# EAGLE design quadcopter (EAGLE 8.1.1)
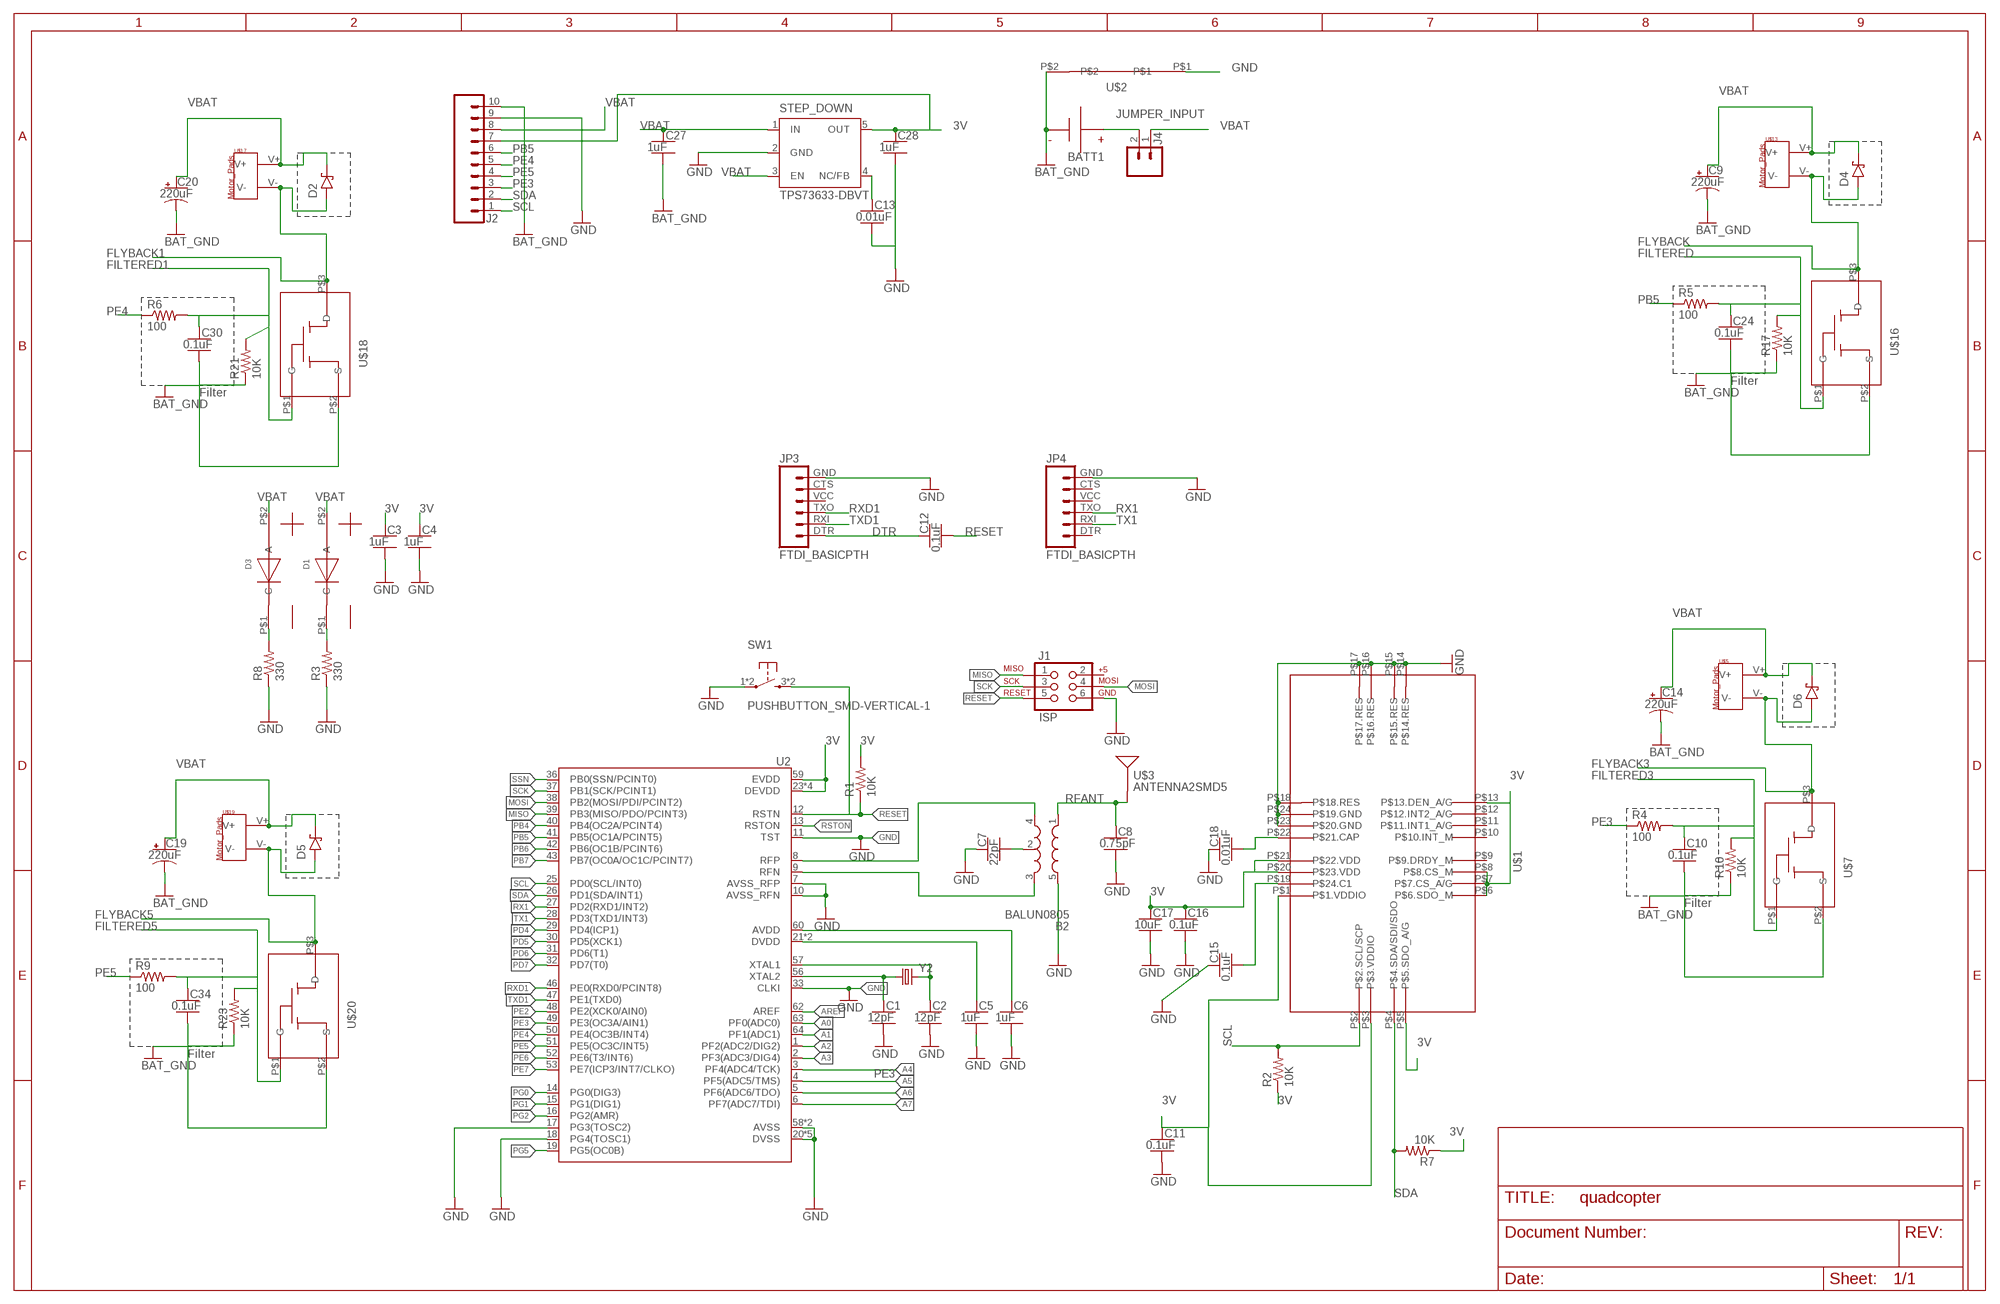
[diagram p0: schematic, sheet 1]

## Parts
B2  BALUN0805  [BALUN]
BATT1  BATTERY-HUBSAN-W/HOLDER  [BATTERY-W/HOLDER-380MAH-HUBSAN]
C1  12pF  CAPACITOR-NP_SMD-2012-0805_CERAMIC-12PF  [CAPC2012X140_HS]
C2  12pF  CAPACITOR-NP_SMD-2012-0805_CERAMIC-12PF  [CAPC2012X140_HS]
C3  1uF  CAPACITOR-NP_SMD-2012-0805_CERAMIC-1UF  [CAPC2012X140_HS]
C4  1uF  CAPACITOR-NP_SMD-2012-0805_CERAMIC-1UF  [CAPC2012X140_HS]
C5  1uF  CAPACITOR-NP_SMD-2012-0805_CERAMIC-1UF  [CAPC2012X140_HS]
C6  1uF  CAPACITOR-NP_SMD-2012-0805_CERAMIC-1UF  [CAPC2012X140_HS]
C7  22pF  CAPACITOR-NP_SMD-2012-0805_CERAMIC-22PF  [CAPC2012X140_HS]
C8  0.75pF  CAPACITOR-NP_SMD-2012-0805_CERAMIC-0.75PF  [CAPC2012X140_HS]
C9  220uF  CAPACITOR-POL_SMD-7043-D_TANTALUM-220UF  [CAPMP7343X310_HS]
C10  0.1uF  CAPACITOR-NP_SMD-2012-0805_CERAMIC-0.1UF  [CAPC2012X140_HS]
C11  0.1uF  CAPACITOR-NP_SMD-2012-0805_CERAMIC-0.1UF  [CAPC2012X140_HS]
C12  0.1uF  CAPACITOR-NP_SMD-2012-0805_CERAMIC-0.1UF  [CAPC2012X140_HS]
C13  0.01uF  CAPACITOR-NP_SMD-2012-0805_CERAMIC-0.01UF  [CAPC2012X140_HS]
C14  220uF  CAPACITOR-POL_SMD-7043-D_TANTALUM-220UF  [CAPMP7343X310_HS]
C15  0.1uF  CAPACITOR-NP_SMD-2012-0805_CERAMIC-0.1UF  [CAPC2012X140_HS]
C16  0.1uF  CAPACITOR-NP_SMD-2012-0805_CERAMIC-0.1UF  [CAPC2012X140_HS]
C17  10uF  CAPACITOR-NP_SMD-2012-0805_CERAMIC-10UF  [CAPC2012X140_HS]
C18  0.01uF  CAPACITOR-NP_SMD-2012-0805_CERAMIC-0.01UF  [CAPC2012X140_HS]
C19  220uF  CAPACITOR-POL_SMD-7043-D_TANTALUM-220UF  [CAPMP7343X310_HS]
C20  220uF  CAPACITOR-POL_SMD-7043-D_TANTALUM-220UF  [CAPMP7343X310_HS]
C24  0.1uF  CAPACITOR-NP_SMD-2012-0805_CERAMIC-0.1UF  [CAPC2012X140_HS]
C27  1uF  CAPACITOR-NP_SMD-2012-0805_CERAMIC-1UF  [CAPC2012X140_HS]
C28  1uF  CAPACITOR-NP_SMD-2012-0805_CERAMIC-1UF  [CAPC2012X140_HS]
C30  0.1uF  CAPACITOR-NP_SMD-2012-0805_CERAMIC-0.1UF  [CAPC2012X140_HS]
C34  0.1uF  CAPACITOR-NP_SMD-2012-0805_CERAMIC-0.1UF  [CAPC2012X140_HS]
D1  LED-RED  [RED_LED]
D2  DIODE-SCHOTTKY_SMD-SOD123  [SOD3716X135_HS]
D3  LED-RED  [RED_LED]
D4  DIODE-SCHOTTKY_SMD-SOD123  [SOD3716X135_HS]
D5  DIODE-SCHOTTKY_SMD-SOD123  [SOD3716X135_HS]
D6  DIODE-SCHOTTKY_SMD-SOD123  [SOD3716X135_HS]
J1  ISP  AVR_SPI_PRG_6NS  [2X3-NS]
J2  SIP-10_TH-254X10-1  [HDRV10W63P254_10X1_2540X254H838_HS]
J4  MALE_HEADER_2POS-2X1-0.1IN  [MALE_HEADER_2X1_0.1IN]
JP3  FTDI_BASICPTH  [FTDI_BASIC]
JP4  FTDI_BASICPTH  [FTDI_BASIC]
R1  10K  RESISTOR_SMD-2012-0805-10K  [RESC2012X60_HS]
R2  10K  RESISTOR_SMD-2012-0805-10K  [RESC2012X60_HS]
R3  330  RESISTOR_SMD-2012-0805-330  [RESC2012X60_HS]
R4  100  RESISTOR_SMD-2012-0805-100  [RESC2012X60_HS]
R5  100  RESISTOR_SMD-2012-0805-100  [RESC2012X60_HS]
R6  100  RESISTOR_SMD-2012-0805-100  [RESC2012X60_HS]
R7  10K  RESISTOR_SMD-2012-0805-10K  [RESC2012X60_HS]
R8  330  RESISTOR_SMD-2012-0805-330  [RESC2012X60_HS]
R9  100  RESISTOR_SMD-2012-0805-100  [RESC2012X60_HS]
R10  10K  RESISTOR_SMD-2012-0805-10K  [RESC2012X60_HS]
R17  10K  RESISTOR_SMD-2012-0805-10K  [RESC2012X60_HS]
R21  10K  RESISTOR_SMD-2012-0805-10K  [RESC2012X60_HS]
R23  10K  RESISTOR_SMD-2012-0805-10K  [RESC2012X60_HS]
STEP_DOWN  TPS73633-DBVT  [SOT23-DBV]
SW1  PUSHBUTTON_SMD-VERTICAL-1  [TE_FSM8JSMA_HS]
U2  ATMEGA128RFA1  [QFN-64]
U$1  LSM9DS1TR_IMU-9_AXIS  [IMU]
U$2  NET_BRIDGE  [NET_BRIDGE]
U$3  ANTENNA2SMD5  [ANTENNA-CHIP5]
U$5  MOTOR_PADS  [MOTOR_PADS]
U$7  MOSFET-N_CHANNEL  [MOSFET]
U$13  MOTOR_PADS  [MOTOR_PADS]
U$16  MOSFET-N_CHANNEL  [MOSFET]
U$17  MOTOR_PADS  [MOTOR_PADS]
U$18  MOSFET-N_CHANNEL  [MOSFET]
U$19  MOTOR_PADS  [MOTOR_PADS]
U$20  MOSFET-N_CHANNEL  [MOSFET]
Y2  CRYSTAL5X3  [CRYSTAL-SMD-5X3]

## Nets
3V: C3.1 C4.1 C11.1 C16.1 C17.1 C28.1 J2.7 R1.2 R2.1 R7.1 STEP_DOWN.5(OUT) U2.23(DEVDD) U2.34(DEVDD) U2.44(DEVDD) U2.54(DEVDD) U2.59(EVDD) U$1.P$1(P$1.VDDIO) U$1.P$3(P$3.VDDIO) U$1.P$5(P$5.SDO_A/G) U$1.P$6(P$6.SDO_M) U$1.P$7(P$7.CS_A/G) U$1.P$8(P$8.CS_M) U$1.P$13(P$13.DEN_A/G) U$1.P$20(P$23.VDD) U$1.P$21(P$22.VDD)
A0: U2.63(PF0(ADC0))
A1: U2.64(PF1(ADC1))
A2: U2.1(PF2(ADC2/DIG2))
A3: U2.2(PF3(ADC3/DIG4))
A4: U2.3(PF4(ADC4/TCK))
A5: U2.4(PF5(ADC5/TMS))
A6: U2.5(PF6(ADC6/TDO))
A7: U2.6(PF7(ADC7/TDI))
AREF: U2.62(AREF)
AVDD: C6.1 U2.60(AVDD)
BAT_GND [HIGHCURRENT]: BATT1.-(N) C9.2(-) C10.2 C14.2(-) C19.2(-) C20.2(-) C24.2 C27.2 C30.2 C34.2 J2.10 R10.1 R17.1 R21.1 R23.1 U$2.P$2 U$7.P$2(S) U$16.P$2(S) U$18.P$2(S) U$20.P$2(S)
DTR: C12.1 JP3.DTR
DVDD: C5.1 U2.21(DVDD) U2.22(DVDD)
FILTERED [HIGHCURRENT]: C24.1 R5.2 R17.2 U$16.P$1(G)
FILTERED1 [HIGHCURRENT]: C30.1 R6.2 R21.2 U$18.P$1(G)
FILTERED3 [HIGHCURRENT]: C10.1 R4.2 R10.2 U$7.P$1(G)
FILTERED5 [HIGHCURRENT]: C34.1 R9.2 R23.2 U$20.P$1(G)
FLYBACK [HIGHCURRENT]: D4.A U$13.V- U$16.P$3(D)
FLYBACK1 [HIGHCURRENT]: D2.A U$17.V- U$18.P$3(D)
FLYBACK3 [HIGHCURRENT]: D6.A U$5.V- U$7.P$3(D)
FLYBACK5 [HIGHCURRENT]: D5.A U$19.V- U$20.P$3(D)
GND: B2.5(GND) C1.2 C2.2 C3.2 C4.2 C5.2 C6.2 C7.1 C8.2 C11.2 C13.2 C15.1 C16.2 C17.2 C18.1 C28.2 J1.6 J2.9 JP3.GND JP4.GND R3.1 R8.1 STEP_DOWN.2(GND) SW1.1 SW1.2 U2.7(AVSS_RFP) U2.10(AVSS_RFN) U2.11(TST) U2.17(PG3(TOSC2)) U2.18(PG4(TOSC1)) U2.20(DVSS) U2.24(DVSS) U2.33(CLKI) U2.35(DVSS) U2.45(DVSS) U2.55(DVSS) U2.58(AVSS) U2.61(AVSS) U$1.P$14(P$14.RES) U$1.P$15(P$15.RES) U$1.P$16(P$16.RES) U$1.P$17(P$17.RES) U$1.P$18(P$18.RES) U$1.P$23(P$20.GND) U$1.P$24(P$19.GND) U$2.P$1
JUMPER_INPUT [HIGHCURRENT]: BATT1.+(P) J4.2
MISO: J1.1 U2.39(PB3(MISO/PDO/PCINT3))
MOSI: J1.4 U2.38(PB2(MOSI/PDI/PCINT2))
N$2: C13.1 STEP_DOWN.4(NC/FB)
N$3: C2.1 U2.57(XTAL1) Y2.3
N$4: C1.1 U2.56(XTAL2) Y2.1
N$5: C18.2 U$1.P$22(P$21.CAP)
N$6: C15.2 U$1.P$19(P$24.C1)
N$7: B2.2(GND) C7.2
N$10: D3.P$1(C) R8.2
N$12: D1.P$1(C) R3.2
PB4: U2.40(PB4(OC2A/PCINT4))
PB5: J2.6 R5.1 U2.41(PB5(OC1A/PCINT5))
PB6: U2.42(PB6(OC1B/PCINT6))
PB7: U2.43(PB7(OC0A/OC1C/PCINT7))
PD4: U2.29(PD4(ICP1))
PD5: U2.30(PD5(XCK1))
PD6: U2.31(PD6(T1))
PD7: U2.32(PD7(T0))
PE2: U2.48(PE2(XCK0/AIN0))
PE3: J2.3 R4.1 U2.49(PE3(OC3A/AIN1))
PE4: J2.5 R6.1 U2.50(PE4(OC3B/INT4))
PE5: J2.4 R9.1 U2.51(PE5(OC3C/INT5))
PE6: U2.52(PE6(T3/INT6))
PE7: U2.53(PE7(ICP3/INT7/CLKO))
PG0: U2.14(PG0(DIG3))
PG1: U2.15(PG1(DIG1))
PG2: U2.16(PG2(AMR))
PG5: U2.19(PG5(OC0B))
RESET: C12.2 J1.5 R1.1 SW1.3 SW1.4 U2.12(RSTN)
RFANT [RFSIG]: B2.1(IN) C8.1 U$3.FEED(SIGNAL)
RFN: B2.3(OUT2) U2.9(RFN)
RFP: B2.4(OUT1) U2.8(RFP)
RSTON: U2.13(RSTON)
RX1: JP4.TXO U2.27(PD2(RXD1/INT2))
RXD1: JP3.TXO U2.46(PE0(RXD0/PCINT8))
SCK: J1.3 U2.37(PB1(SCK/PCINT1))
SCL: J2.1 R2.2 U2.25(PD0(SCL/INT0)) U$1.P$2(P$2.SCL/SCP)
SDA: J2.2 R7.2 U2.26(PD1(SDA/INT1)) U$1.P$4(P$4.SDA/SDI/SDO)
SSN: U2.36(PB0(SSN/PCINT0))
TX1: JP4.RXI U2.28(PD3(TXD1/INT3))
TXD1: JP3.RXI U2.47(PE1(TXD0))
VBAT [HIGHCURRENT]: C9.1(+) C14.1(+) C19.1(+) C20.1(+) C27.1 D1.P$2(A) D2.C D3.P$2(A) D4.C D5.C D6.C J2.8 J4.1 STEP_DOWN.1(IN) STEP_DOWN.3(EN) U$5.V+ U$13.V+ U$17.V+ U$19.V+
Unconnected: J1.2 JP3.CTS JP3.VCC JP4.CTS JP4.DTR JP4.VCC U$1.P$9(P$9.DRDY_M) U$1.P$10(P$10.INT_M) U$1.P$11(P$11.INT1_A/G) U$1.P$12(P$12.INT2_A/G)

## Notes on the sheet
- Filter
- Filter
- Filter
- Filter

## Library data of the parts
B2 = quadparts_prebuilt:BALUN: 0805 footprint balun- Ember 351/357; DATASHEET: http://katalog.we-online.de/pbs/datasheet/748421245.pdf; DIST: Digikey; DISTPN: 732-2230-6-ND; MFR: Wurth Electronics Inc; MPN: 748421245; PRICE: 2.63
BATT1 = quadparts_prebuilt:BATTERY; CREATOR: Swanson; DIST: AMAZON; DISTPN: http://www.amazon.com/dp/B00RROB6Q4?smid=AMNTPWSAB5H0S; MFR: HUBSAN; MPN: X4-H107C-8-in-1
C1 C2 = quadparts_prebuilt:CAPACITOR-NP_: Nonpolarized capacitor; DIST: Digikey; DISTPN: 490-5531-1-ND; MFR: Murata Electronics North America; MPN: GRM21A5C2E120JW01D
C3-C6 C27 C28 = quadparts_prebuilt:CAPACITOR-NP_: Nonpolarized capacitor; DIST: Digikey; DISTPN: 490-4736-1-ND; MFR: Murata Electronics North America; MPN: GRM21BR71H105KA12L
C7 = quadparts_prebuilt:CAPACITOR-NP_: Nonpolarized capacitor; DIST: Digikey; DISTPN: 490-5534-1-ND; MFR: Murata Electronics North America; MPN: GRM21A5C2E220JW01D
C8 = quadparts_prebuilt:CAPACITOR-NP_: Nonpolarized capacitor; DIST: Digikey; DISTPN: 490-3585-1-ND; MFR: Murata Electronics North America; MPN: GQM2195C2AR75CB01D
C9 C14 C19 C20 = quadparts_prebuilt:CAPACITOR-POL_: Polarized capacitor; DIST: Digikey; DISTPN: 478-8912-1-ND; MFR: AVX Corporation; MPN: TAJD227K006RNJ
C10-C12 C15 C16 C24 C30 C34 = quadparts_prebuilt:CAPACITOR-NP_: Nonpolarized capacitor; DIST: Digikey; DISTPN: 490-1666-1-ND; MFR: Murata Electronics North America; MPN: GRM21BR71H104KA01L
C13 C18 = quadparts_prebuilt:CAPACITOR-NP_: Nonpolarized capacitor; DIST: Digikey; DISTPN: 490-8295-1-ND; MFR: Murata Electronics North America; MPN: GRM2195C1H103FA01D
C17 = quadparts_prebuilt:CAPACITOR-NP_: Nonpolarized capacitor; DIST: Digikey; DISTPN: 490-5523-1-ND; MFR: Murata Electronics North America; MPN: GRM21BR61E106KA73L
D1 D3 = quadparts_michael:LED; CREATOR: Michael Bagherpour; DIST: Digikey; DISTPN: 160-1178-1-ND; MFR: Lite-On Inc; MPN: LTST-C170EKT; REVIEWER: group 4
D2 D4-D6 = quadparts_prebuilt:DIODE-SCHOTTKY_: Schottky diode
J1 = quadparts_prebuilt:AVR_SPI_PRG_6: AVR ISP 6 Pin This is the reduced ISP connector for AVR programming. Common on Arduino. This footprint will take up less PCB space and can be used with a 10-pin to 6-pin adapter such as SKU: BOB-08508; DATASHEET: http://portal.fciconnect.com/Comergent//fci/drawing/67996.pdf; DIST: Digikey; DISTPN: 609-3234-ND; MFR: Amphenol FCI; MPN: 67997-206HLF; PRICE: 0.31
J2 = quadparts_prebuilt:SIP-10_: 10 pin single inline pin header, socket, or connector; DIST: Digikey; DISTPN: 609-3250-ND; MFR: Amphenol FCI; MPN: 68000-110HLF
J4 = quadparts_michael:MALE_HEADER_2POS: 2 pin single inline pin header, socket, or connector; CREATOR: SWANSON; DIST: Digikey; DISTPN: 3M9447-ND; MFR: 3M; MPN: 961102-6404-AR; REVIEWER: group 4
JP3 JP4 = quadparts_prebuilt:FTDI_BASIC: FTDI Basic header with labels; DATASHEET: http://portal.fciconnect.com/Comergent//fci/drawing/68015.pdf; DIST: Digikey; DISTPN: 609-3327-ND; MFR: Amphenol FCI; MPN: 68016-406HLF; PRICE: 0.33
R1 R2 R7 R10 R17 R21 R23 = quadparts_prebuilt:RESISTOR_: Resistor; DIST: Digikey; DISTPN: 311-10KARCT-ND; MFR: Yageo; MPN: RC0805JR-0710KL
R3 R8 = quadparts_prebuilt:RESISTOR_: Resistor; DIST: Digikey; DISTPN: 311-330ARCT-ND; MFR: Yageo; MPN: RC0805JR-07330RL
R4-R6 R9 = quadparts_prebuilt:RESISTOR_: Resistor; DIST: Digikey; DISTPN: 311-100ARCT-ND; MFR: Yageo; MPN: RC0805JR-07100RL
STEP_DOWN = quadparts_prebuilt:TPS73633-DBVT; DATASHEET: http://www.ti.com/lit/ds/symlink/lp3985.pdf; DIST: Digikey; DISTPN: LP3985IM5X-3.0/NOPBCT-ND; MFR: Texas Instruments; MPN: LP3985IM5X-3.0/NOPB; PRICE: 0.59
SW1 = quadparts_prebuilt:PUSHBUTTON_: Pushbutton with 2 pins shorting 1 to 2 and two extra mounting pins 3 & 4; DIST: Digikey; DISTPN: 450-1129-ND; MFR: TE Connectivity Alcoswitch Switches; MPN: FSM4JSMA
U2 = quadparts_prebuilt:ATMEGA128RFA1: ATmega128RFA1 8-bit AVR Microcontroller with Low Power 2.4GHz Transceiver for ZigBee and IEEE 802.15.4; CREATOR: Swanson; DATASHEET: http://www.atmel.com/Images/Atmel-8266-MCU_Wireless-ATmega128RFA1_Datasheet.pdf; DIST: Digikey; DISTPN: ATMEGA128RFA1-ZUR00DKR-ND; MFR: Atmel; MPN: ATMEGA128RFA1-ZUR00; PRICE: 10.21
U$1 = quadparts_michael:LSM9DS1TR_IMU; CREATOR: Michael Bagherpour; DIST: Digikey; DISTPN: 497-14946-1-ND; MFR: STMicroelectronics; MPN: LSM9DS1TR; REVIEWER: group 4
U$2 = quadparts_michael:NET_BRIDGE; CREATOR: Michael; DIST: none; DISTPN: none; MFR: none; MPN: none; REVIEWER: group 4
U$3 = quadparts_prebuilt:ANTENNA2: Chip antenna Single endded antenna. Common with smaller chip antennas. CHIP4 package is the GPS Chip Antenna SKU: GPS-08418. CHIP5 package is 2.4GHz chip antenna SKU: WRL-00144.; DATASHEET: http://www.linxtechnologies.com/resources/data-guides/ant-xxx-chp-x.pdf; DIST: Digikey; DISTPN: ANT-2.45-CHPCT-ND; MFR: Linx Technologies Inc.; MPN: ANT-2.45-CHP-T; PRICE: 3.16
U$5 U$13 U$17 U$19 = quadparts_prebuilt:MOTOR_PADS; DIST: NA; DISTPN: NA; MFR: NA; MPN: NA
U$7 U$16 U$18 U$20 = quadparts_michael:MOSFET; CREATOR: Michael Bagherpour; DIST: Digikey; DISTPN: SI2302CDS-T1-E3CT-ND; MFR: Vishay Siliconix; MPN: SI2302CDS-T1-E3; REVIEWER: group 4
Y2 = quadparts_prebuilt:CRYSTAL: Various standard crystals. Proven footprints.; DATASHEET: http://www.abracon.com/Resonators/abm3b.pdf; DIST: Digikey; DISTPN: 535-9122-1-ND; MFR: Abracon LLC; MPN: ABM3B-16.000MHZ-B2-T; PRICE: 0.68; PROD_ID: XTAL-08218

## Net classes
1 RFSIG: width 0.457 mm
2 HIGHCURRENT: width 0.457 mm

## Board
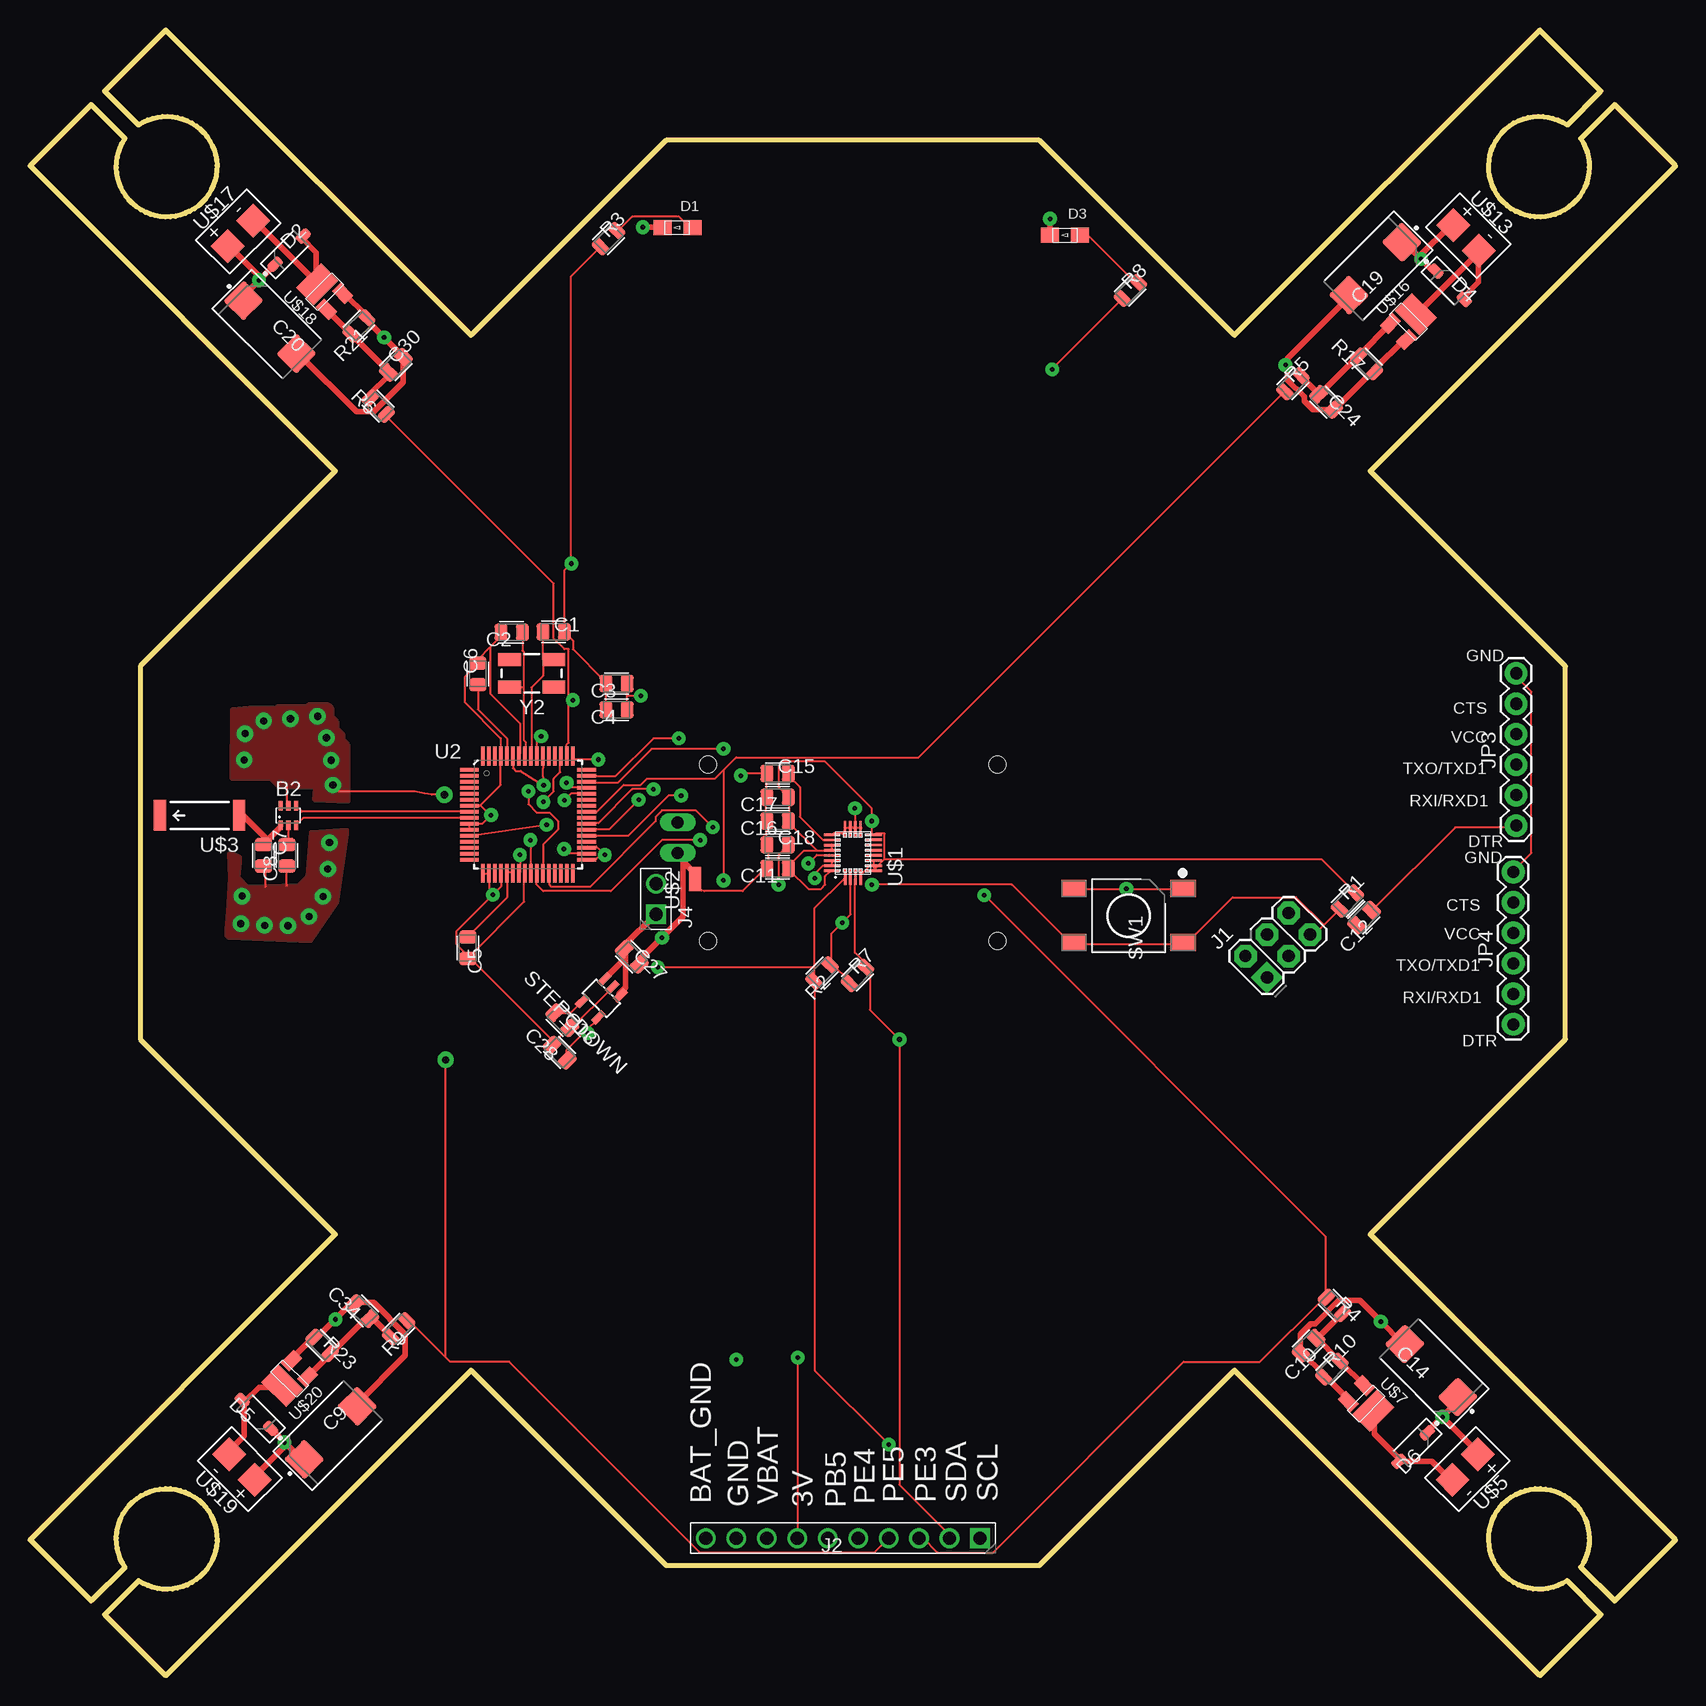
[diagram p1: board, top side]
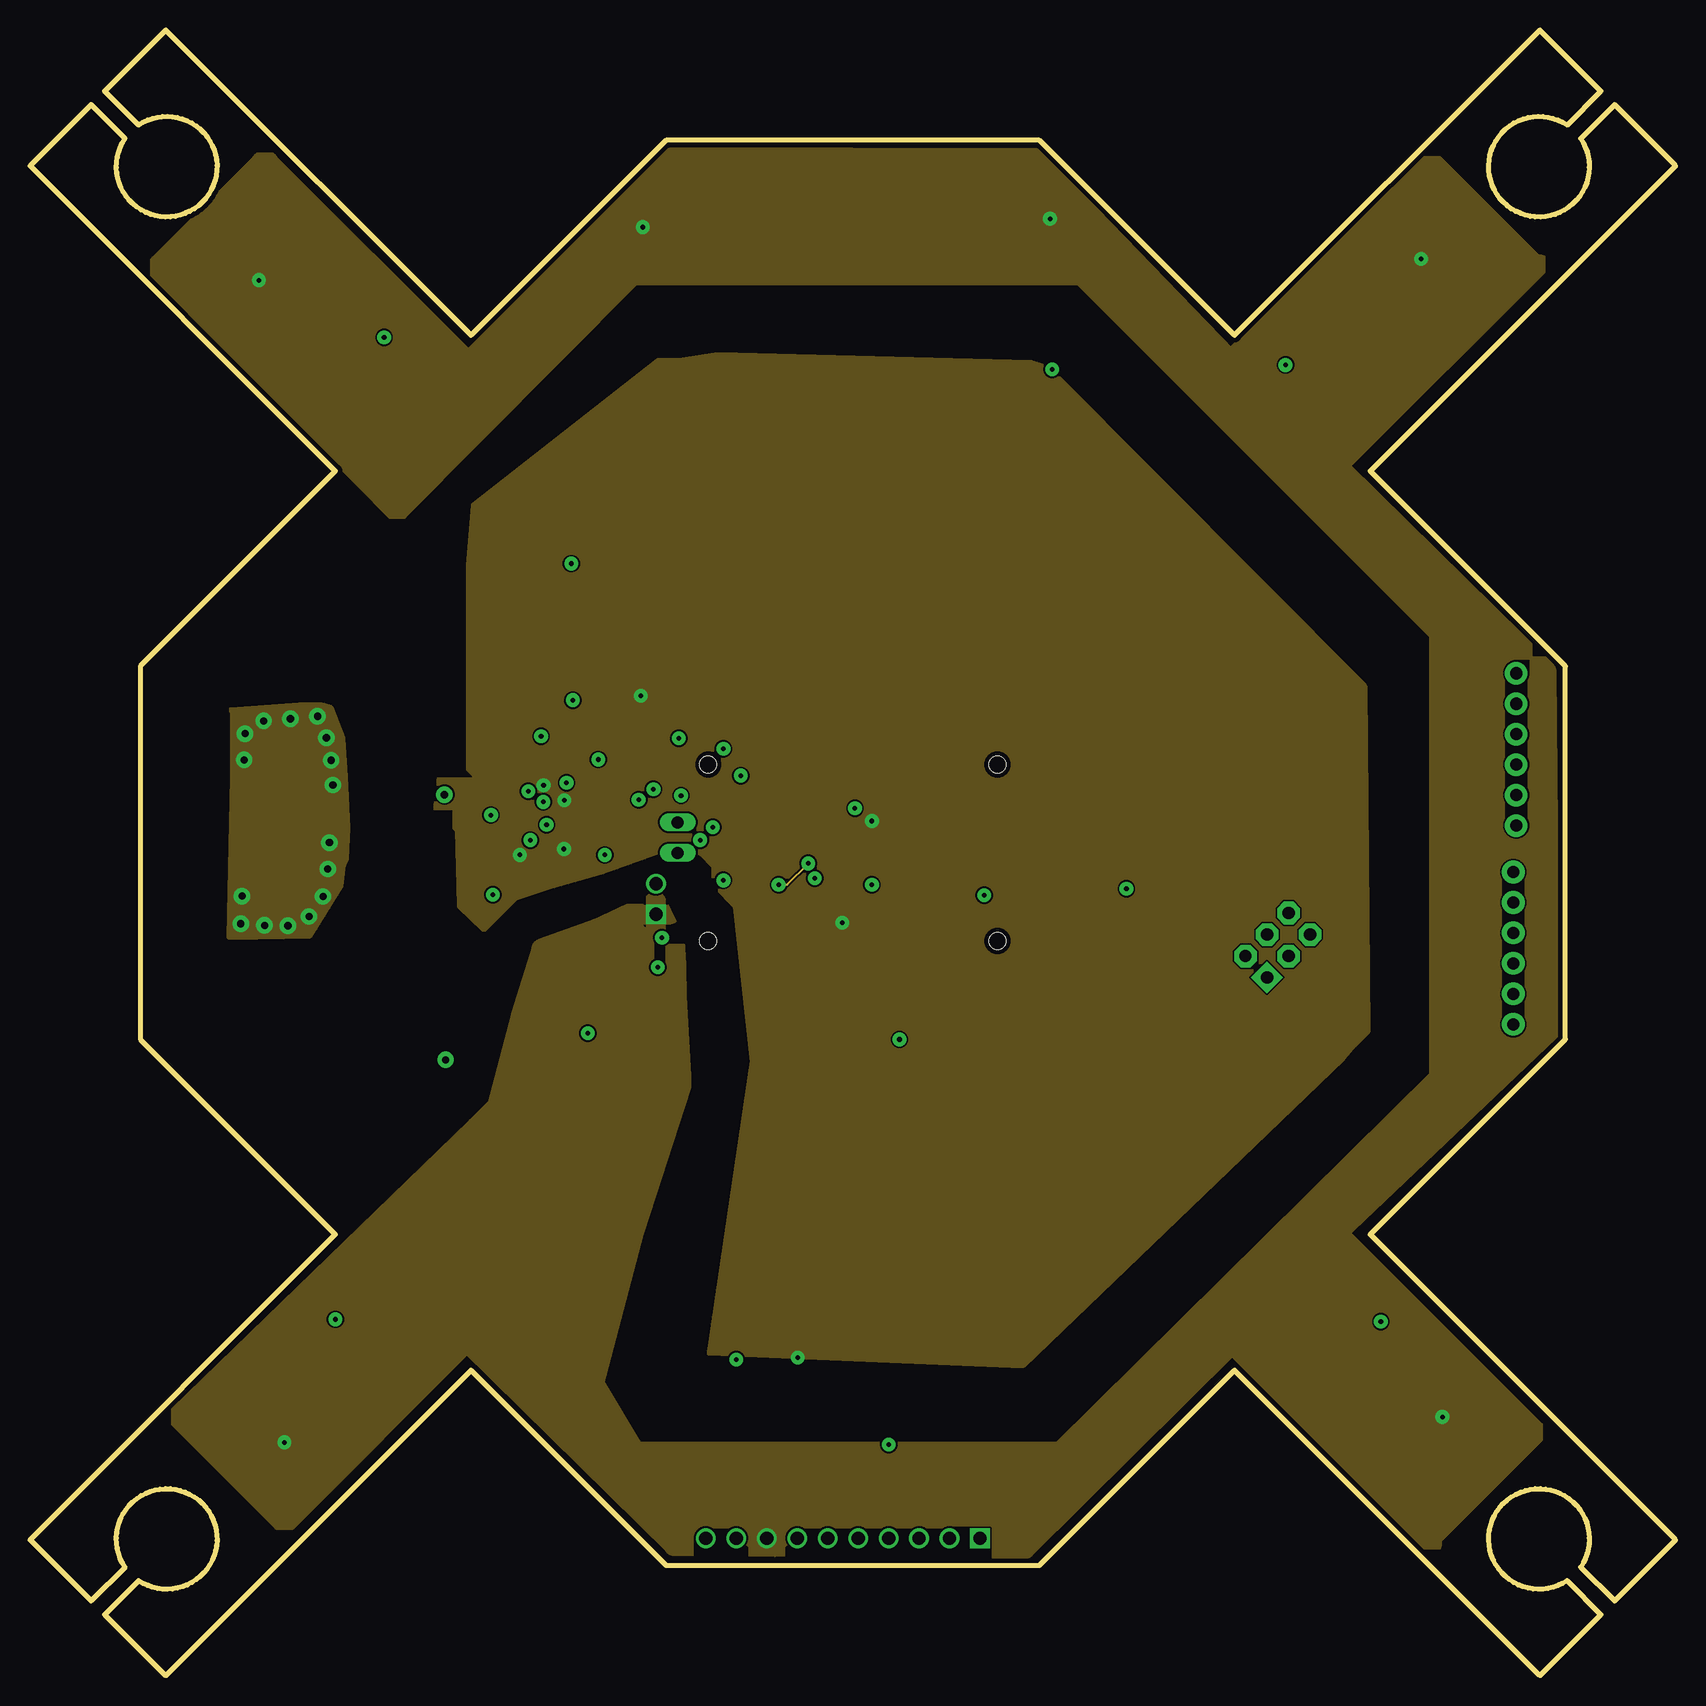
[diagram p2: board, inner layer Route2]
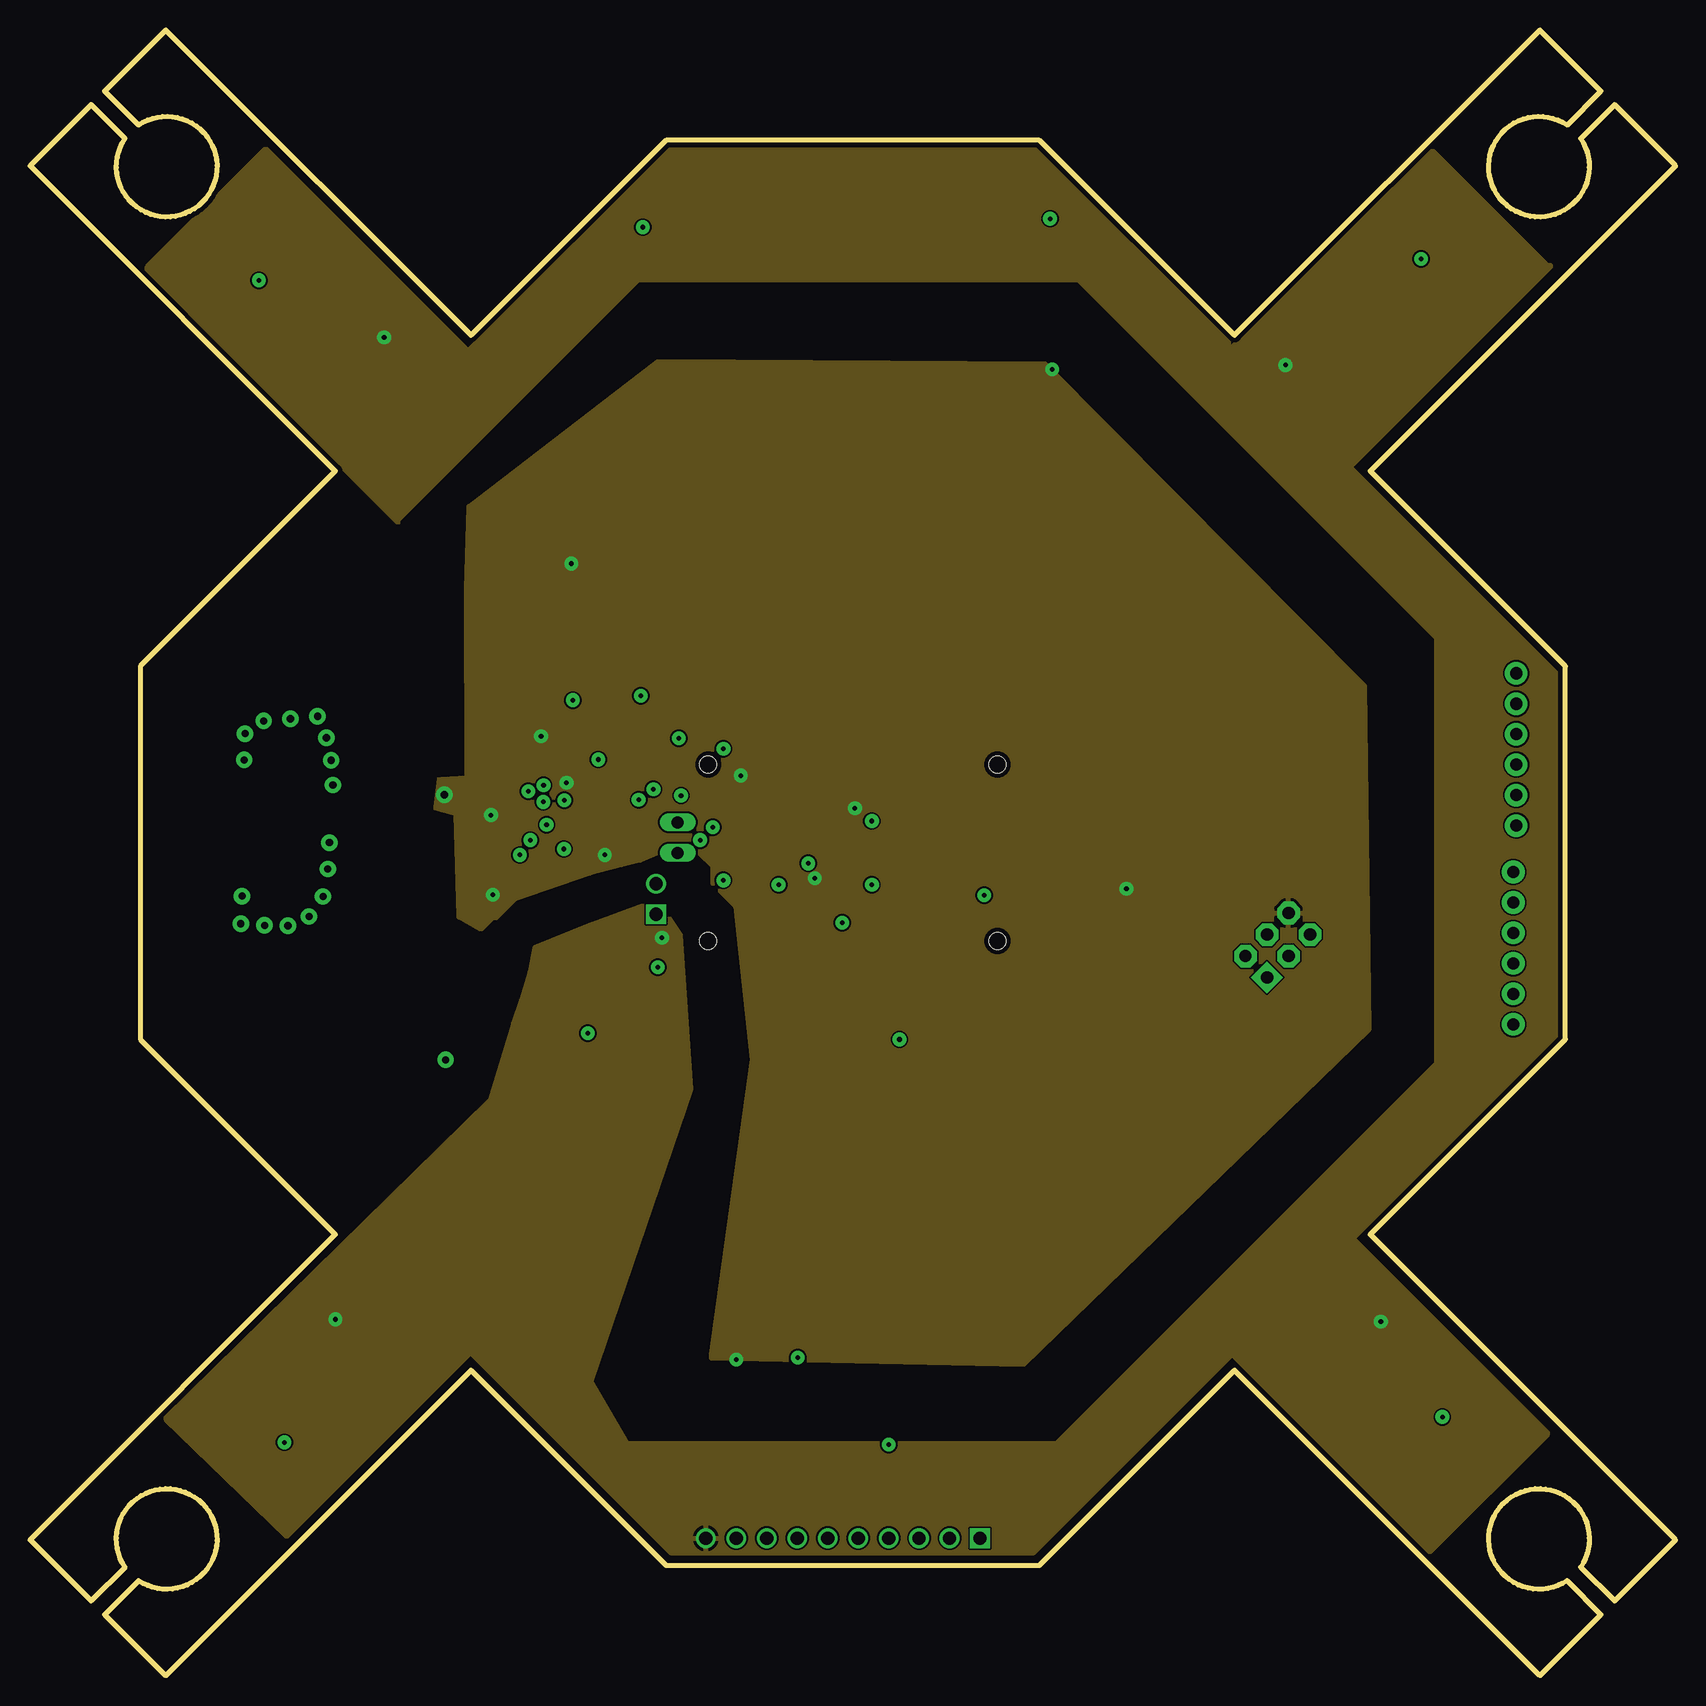
[diagram p3: board, inner layer Route15]
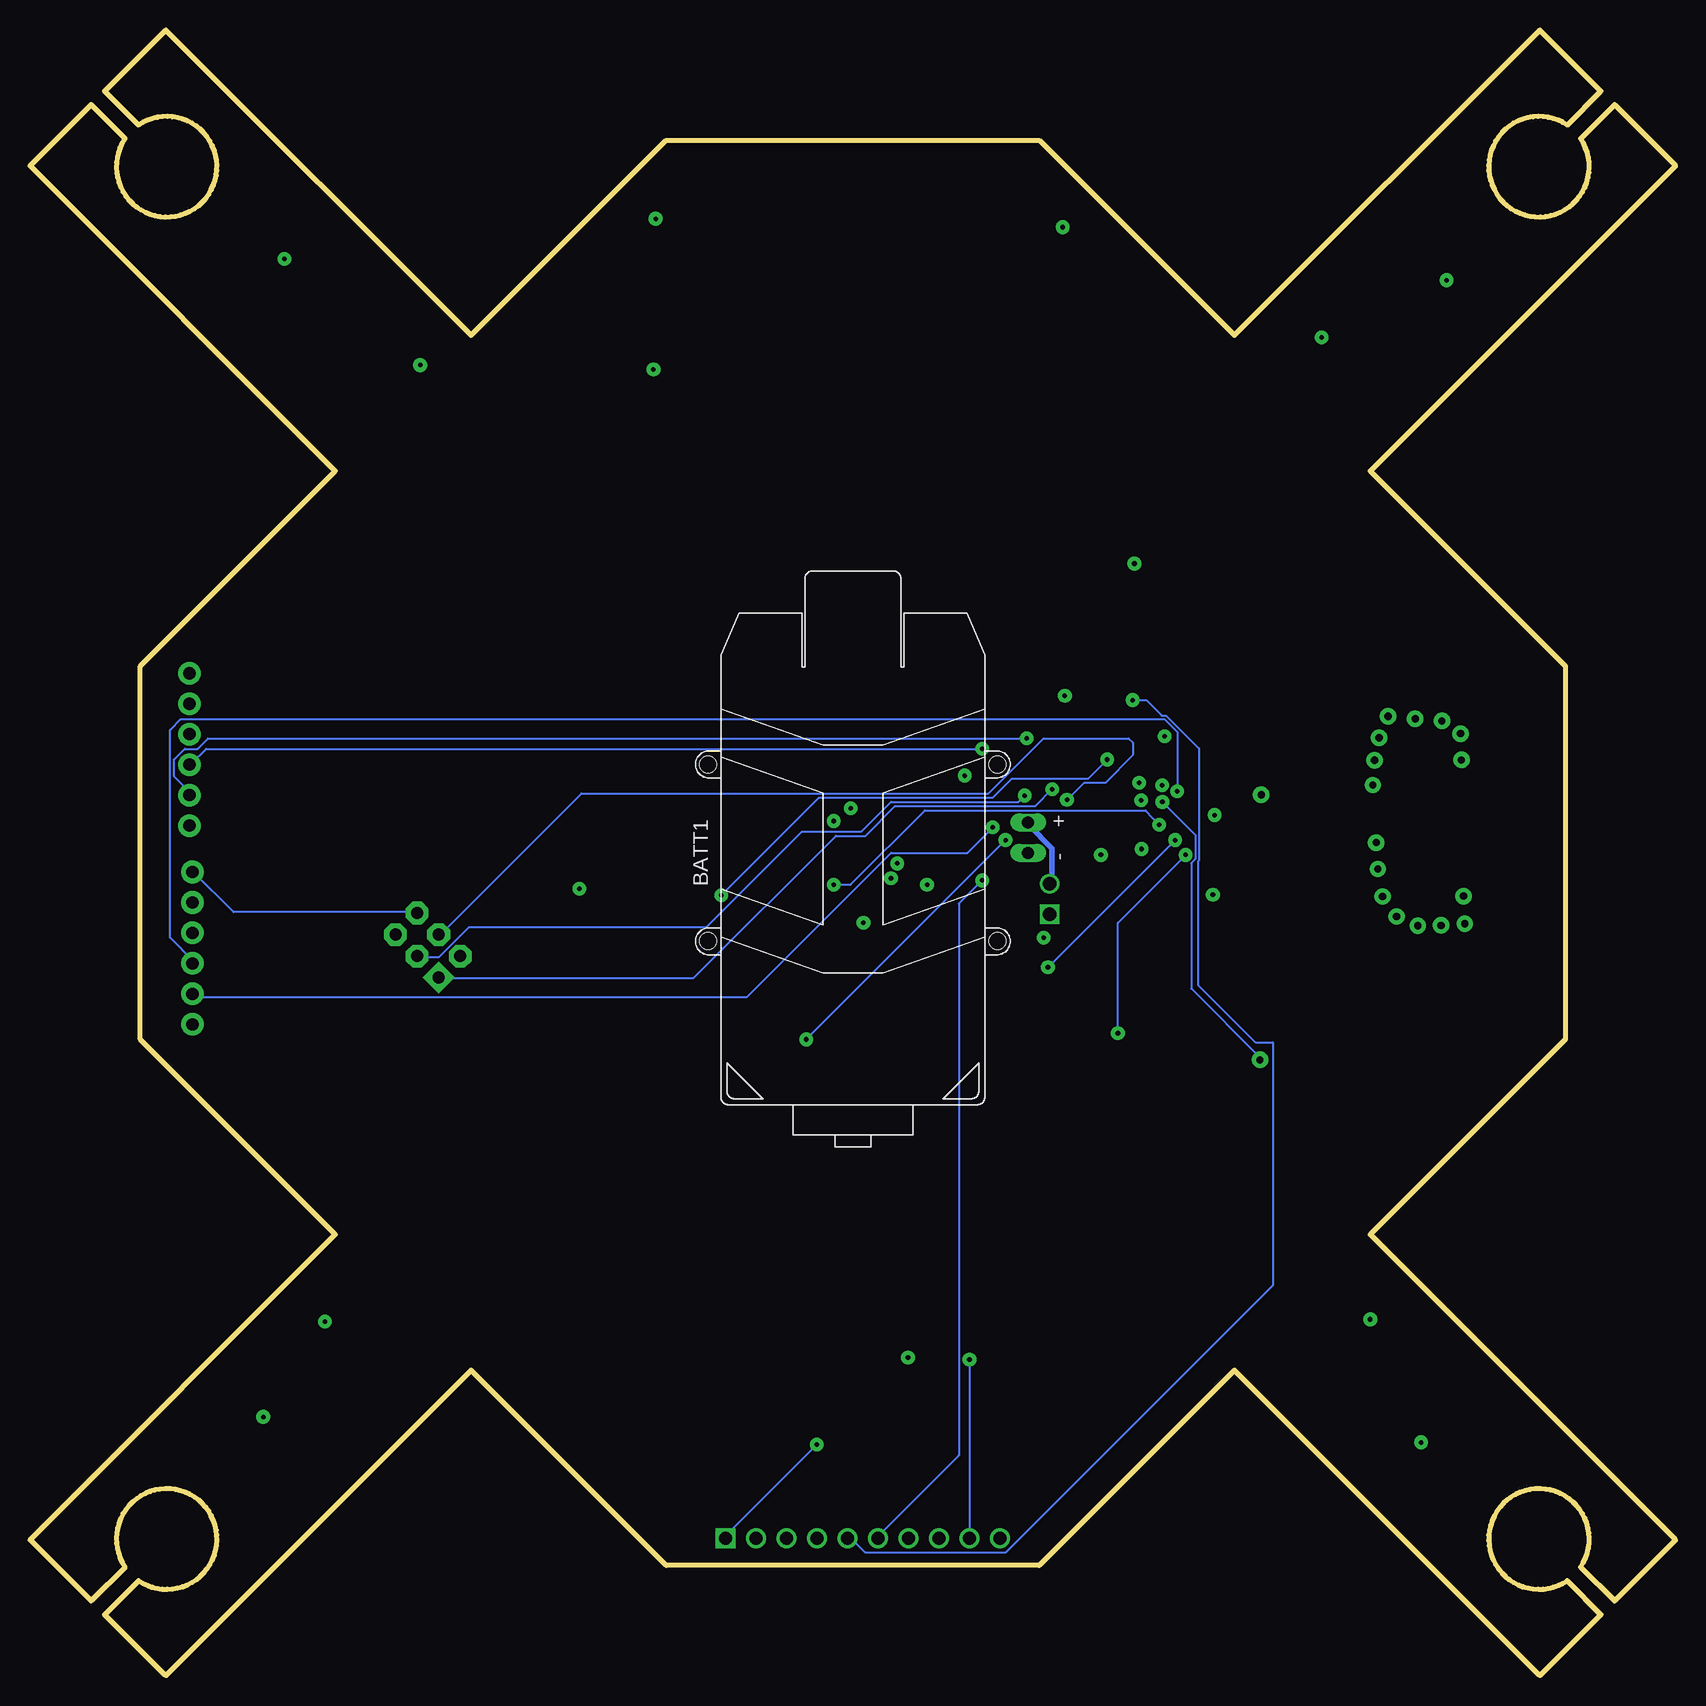
[diagram p4: board, bottom side, seen from below]

Size 137.18 x 137.18 mm. Coordinates in mm from the lower left corner, seen from the top.
Outline: 137.18,11.31 111.72,36.77 127.99,53.03 127.99,84.15 111.72,100.41 137.18,125.87 132.09,130.96 129.26,128.13 arc-338 128.13,129.26 130.96,132.09 125.86,137.18 100.41,111.72 84.15,127.99 53.03,127.99 36.77,111.72 11.31,137.18 6.22,132.09 9.05,129.26 arc-338 7.92,128.13 5.09,130.96 0,125.87 25.46,100.41 9.19,84.15 9.19,53.03 25.46,36.77 0,11.31 5.09,6.22 7.92,9.05 arc-338 9.05,7.92 6.22,5.09 11.31,0 36.77,25.46 53.03,9.19 84.15,9.19 100.41,25.46 125.86,0 130.96,5.09 128.13,7.92 arc-338 129.26,9.05 132.09,6.22 137.18,11.31
Copper layers (1*2*15*16): Top 0.035559375mm / dielectric 1.501140625mm / Route2 0.035559375mm / dielectric 0.149859375mm / Route15 0.035559375mm / dielectric 0.200659375mm / Bottom 0.035559375mm
Design rules "Michael-and-Tawfic-4pcb-66board": minimum track width 6mil, minimum drill 15mil, track to track 6mil, track to pad 6mil, pad to pad 6mil, via to via 6mil, smd to smd 6mil, copper to edge 15mil, drill to drill 10mil, minimum pad ring 10mil, minimum via ring 15mil, stop-mask expansion 4mil, vias tented up to drill 0mil, thermal gap 10mil
tKeepout: 6 lines
bKeepout: 6 lines
tRestrict: area 9.6,67.7 to 18.6,76; area 67.8,67.5 to 69.4,69.6
bRestrict: area 18.6,63.7 to 23.7,78.7; area 67.8,67.5 to 69.4,69.6

### Footprints (pad centres in the part's own frame; a part is rotated, then mirrored left to right if it is on the bottom)
BALUN = smd 0.35 x 0.8: 1 -0.65,-0.8; 2 0,-0.8; 3 0.65,-0.8; 4 0.65,0.8; 5 0,0.8; 6 -0.65,0.8
BATTERY-W/HOLDER-380MAH-HUBSAN = drill 1 long: + -2.54,14.605; - 0,14.605 | hole 1.4: -7.35,-12.05; -7.35,12.05; 7.35,-12.05; 7.35,12.05
CAPC2012X140_HS = smd 1.08 x 1.42: 1 -0.895,0; 2 0.895,0
CAPMP7343X310_HS = smd 2.37 x 2.43: 1 -3.12,0; 2 3.12,0
RED_LED = smd 1.5 x 1.25: P$1 -1.27,0.01; P$2 1.23,0.01
SOD3716X135_HS = smd 1.25 x 0.8: A 1.665,0; C -1.665,0
2X3-NS = drill 1.016 pad 1.88 square: 1 -2.54,-1.27 | drill 1.016 pad 1.88 octagon: 2 -2.54,1.27; 3 0,-1.27; 4 0,1.27; 5 2.54,-1.27; 6 2.54,1.27
HDRV10W63P254_10X1_2540X254H838_HS = drill 1.1 pad 1.65 square: 1 0,0 | drill 1.1 pad 1.65: 2 2.54,0; 3 5.08,0; 4 7.62,0; 5 10.16,0; 6 12.7,0; 7 15.24,0; 8 17.78,0; 9 20.32,0; 10 22.86,0
MALE_HEADER_2X1_0.1IN = drill 1.1 pad 1.65 square: 1 0,0 | drill 1.1 pad 1.65: 2 2.54,0
FTDI_BASIC = drill 1.016 pad 1.88: CTS 10.16,0; DTR 0,0; GND 12.7,0; RXI 2.54,0; TXO 5.08,0; VCC 7.62,0
RESC2012X60_HS = smd 0.92 x 1.38: 1 -0.955,0; 2 0.955,0
SOT23-DBV = smd 0.55 x 1.2: 1 -0.95,-1.3; 2 0,-1.3; 3 0.95,-1.3; 4 0.95,1.3; 5 -0.95,1.3
TE_FSM8JSMA_HS = smd 1.4 x 2.1: 1 -2.25,4.55; 2 -2.25,-4.55; 3 2.25,4.55; 4 2.25,-4.55
QFN-64 = smd 1.562 x 0.28: 1 -4.881,3.75; 2 -4.881,3.25; 3 -4.881,2.75; 4 -4.881,2.25; 5 -4.881,1.75; 6 -4.881,1.25; 7 -4.881,0.75; 8 -4.881,0.25; 9 -4.881,-0.25; 10 -4.881,-0.75; 11 -4.881,-1.25; 12 -4.881,-1.75; 13 -4.881,-2.25; 14 -4.881,-2.75; 15 -4.881,-3.25; 16 -4.881,-3.75; 33 4.881,-3.75; 34 4.881,-3.25; 35 4.881,-2.75; 36 4.881,-2.25; 37 4.881,-1.75; 38 4.881,-1.25; 39 4.881,-0.75; 40 4.881,-0.25; 41 4.881,0.25; 42 4.881,0.75; 43 4.881,1.25; 44 4.881,1.75; 45 4.881,2.25; 46 4.881,2.75; 47 4.881,3.25; 48 4.881,3.75 | smd 0.28 x 1.562: 17 -3.75,-4.881; 18 -3.25,-4.881; 19 -2.75,-4.881; 20 -2.25,-4.881; 21 -1.75,-4.881; 22 -1.25,-4.881; 23 -0.75,-4.881; 24 -0.25,-4.881; 25 0.25,-4.881; 26 0.75,-4.881; 27 1.25,-4.881; 28 1.75,-4.881; 29 2.25,-4.881; 30 2.75,-4.881; 31 3.25,-4.881; 32 3.75,-4.881; 49 3.75,4.881; 50 3.25,4.881; 51 2.75,4.881; 52 2.25,4.881; 53 1.75,4.881; 54 1.25,4.881; 55 0.75,4.881; 56 0.25,4.881; 57 -0.25,4.881; 58 -0.75,4.881; 59 -1.25,4.881; 60 -1.75,4.881; 61 -2.25,4.881; 62 -2.75,4.881; 63 -3.25,4.881; 64 -3.75,4.881
IMU = smd 0.2 x 1.35: P$1 -1.51,1.74; P$6 -1.5,-1.74; P$7 -1.07,-1.74; P$8 -0.64,-1.74; P$9 -0.21,-1.74; P$10 0.22,-1.74; P$11 0.65,-1.74; P$12 1.08,-1.74; P$13 1.51,-1.74; P$18 1.5,1.74; P$19 1.07,1.74; P$20 0.64,1.74; P$21 0.21,1.74; P$22 -0.22,1.74; P$23 -0.65,1.74; P$24 -1.08,1.74 | smd 1.35 x 0.2: P$2 -1.99,0.64; P$3 -1.99,0.21; P$4 -1.99,-0.22; P$5 -1.99,-0.65; P$14 1.98,-0.64; P$15 1.98,-0.21; P$16 1.98,0.22; P$17 1.98,0.65
NET_BRIDGE = smd 1 x 1: P$1 -0.5,0; P$2 0.5,0
ANTENNA-CHIP5 = smd 1.016 x 2.54: FEED -3.302,0; NC 3.302,0
MOTOR_PADS = smd 2 x 2: V+ -1,0; V- 2,0
MOSFET = smd 1.5 x 1: P$1 1.15,-0.95; P$2 1.15,0.95 | smd 2.05 x 2.9: P$3 -0.875,0
CRYSTAL-SMD-5X3 = smd 1.9 x 1.1: 1 -1.85,-1.15; 2 1.85,-1.15; 3 1.85,1.15; 4 -1.85,1.15

### Placement (x,y rotation side)
B2  21.54,71.7 0 top
BATT1  68.59,68.59 270 bottom
C1  43.66,87.01 0 top
C2  40.16,86.97 180 top
C3  48.9,82.7 180 top
C4  48.9,80.5 180 top
C5  36.49,60.67 270 top
C6  37.34,83.51 90 top
C7  21.43,68.38 90 top
C8  19.45,68.38 270 top
C9  25.07,20.24 45 top
C10  106.57,27.5 225 top
C11  62.33,67.28 180 top
C12  111.19,63.18 225 top
C13  44.37,54.62 315 top
C14  116.81,25.43 135 top
C15  62.33,75.2 0 top
C16  62.33,71.24 180 top
C17  62.33,73.22 180 top
C18  62.33,69.26 0 top
C19  112.15,117.27 225 top
C20  20,112.41 315 top
C24  108.04,106.17 315 top
C27  50.17,59.93 315 top
C28  44.16,51.94 135 top
C30  30.5,109.27 45 top
C34  27.71,30.4 135 top
D1  53.95,120.7 180 top
D2  21.6,118.83 45 top
D3  86.27,120.07 180 top
D4  118.37,115.89 315 top
D5  18.88,21.78 135 top
D6  115.29,19.06 225 top
J1  104.02,60.88 45 top
J2  79.2,11.46 180 top
J4  52.18,63.47 90 top
JP3  123.89,70.86 90 top
JP4  123.64,54.29 90 top
R1  109.81,64.56 45 top
R2  66.02,58.58 225 top
R3  48.22,119.78 45 top
R4  108.73,30.87 315 top
R5  105.27,107.69 45 top
R6  29.03,105.82 135 top
R7  68.97,58.38 45 top
R8  91.71,115.47 45 top
R9  30.73,28.89 225 top
R10  108.51,25.55 45 top
R17  111.41,109.35 135 top
R21  27.41,112.49 225 top
R23  24.34,27.55 315 top
STEP_DOWN  47.62,56.46 135 top
SW1  91.57,63.36 270 top
U2  41.51,71.77 0 top
U$1  68.59,68.59 90 top
U$2  55.44,66.4 90 top
U$3  14.14,71.7 180 top
U$5  120,17.75 225 top
U$7  111.37,22.7 135 top
U$13  119.36,120.21 315 top
U$16  114.88,112.86 225 top
U$17  17.18,119.85 45 top
U$18  24.57,115.36 315 top
U$19  18.03,17.04 135 top
U$20  21.66,24.77 45 top
Y2  41.82,83.56 180 top

### Tracks (layer width: path | path; a pad name or v marks a point on that pad's centre or on a via)
3V  (via drill 0.38)
  Top 0.152: C4.1 49.79,81.67 | 49.79,81.67 C3.1 | U$1.P$3 68.41,66.29 68.41,63.46 v67.71,62.76 66.82,61.87 66.82,59.4 R2.1 67,59.22 68.24,57.98 R7.1 | 66.64,68.77 66.82,68.94 66.82,69.3 U$1.P$20 | 65.58,68.77 64.52,68.77 63.29,67.53 C11.1 63.29,67.18 64.88,65.58 65.94,65.58 66.29,65.94 66.29,66.64 66.64,67 U$1.P$1 | 65.58,68.77 66.64,68.77 | 66.64,68.77 U$1.P$21 | 65.58,68.77 63.29,71.06 C16.1 63.29,71.42 63.29,73.19 C17.1 63.11,73.36 62.4,74.07 62.4,75.84 62.76,76.19 66.29,76.19 70.18,72.3 v70.18,71.24 70.18,70.18 U$1.P$13 70.53,70.18 71.24,70.18 71.24,68.06 | 70.36,67.53 70.36,67.18 | U$1.P$5 69.3,66.82 70,67.53 U$1.P$7 70.36,67.53 | 70.36,67.53 70.36,67.88 U$1.P$8 | 70.36,67.18 71.24,68.06 | 70.36,67.18 U$1.P$6 | 71.24,68.06 107.66,68.06 R1.2 | U2.44 45.1,73.52 v44.55,72.97 | U2.54 42.76,75.64 v42.82,74.21 40.91,75.41 40.48,75.41 40.26,75.64 U2.59 | U2.34 44.9,68.52 v44.51,68.91 | v50.91,81.67 49.79,81.67 | v63.99,26.52 63.99,11.67 J2.7 | v40.84,68.41 40.84,67 U2.23 | 46.32,53.74 44.72,52.15 44.72,51.44 C28.1 | 46.32,53.74 47.38,54.8 STEP_DOWN.5 | 46.32,53.74 v46.49,53.56
  Route2 0.152: v63.99,26.52 64,26.61
  Bottom 0.152: v40.84,68.41 46.49,62.76 v46.49,53.56
  pour Route2: 60.2,51.2 56.6,26.91 82.77,25.84 109.46,51.48 110.45,52.61 111.57,53.75 111.3,82.45 85.21,108.68 84.5,109.11 83.44,109.46 57.35,110.1 54.16,109.6 52.33,109.6 36.93,97.57 36.52,92.52 36.52,75.55 37.41,74.67 33.66,74.67 33.52,74.53 33.52,72.41 33.55,72.37 35.25,72.37 35.39,72.23 35.39,70.69 35.59,70.49 35.77,64.16 37.76,62.23 37.9,62.23 40.48,64.81 43.49,65.83 47.62,67 52.71,68.84 55.72,68.59 55.93,68.8 55.93,68.52 56.99,67.46 56.99,66.11 56.6,65.73 57.17,65.73 58.76,64.13
AVDD
  Top 0.152: C6.1 37.34,80.54 39.77,78.1 39.77,76.67 U2.60
BAT_GND  (via drill 0.38)
  Top 0.457: U$18.P$2 26.16,115.26 28.11,113.31 R21.1 28.11,112.96 v29.52,111.55 31.11,109.96 C30.2 31.11,109.6 31.11,107.83 28.64,105.36 27.22,105.36 22.45,110.13 C20.2 | U$20.P$2 21.74,26.34 23.51,28.11 R23.1 23.86,28.11 v25.46,29.7 26.87,31.11 C34.2 27.22,31.11 28.64,31.11 31.29,28.46 31.29,26.69 27.22,22.63 C9.2 | U$7.P$2 109.95,22.98 108.01,24.93 R10.1 107.83,25.1 106.07,26.87 C10.2 105.89,27.05 105.89,28.46 106.77,29.34 107.13,29.34 109.07,31.29 110.84,31.29 v112.61,29.52 114.37,27.75 C14.2 | U$16.P$2 114.55,111.37 112.08,108.89 R17.1 111.9,108.72 108.72,105.54 C24.2 108.36,105.54 106.95,105.54 106.24,106.24 106.24,106.6 104.83,108.01 104.83,109.25 | 104.83,109.25 104.83,109.78 109.95,114.9 C19.2 | v104.65,109.25 104.83,109.25 | 54.45,67.88 53.92,68.41 BATT1.- 54.45,67.88 | 54.45,67.88 55.33,67 U$2.P$2 | 54.45,67.88 54.45,63.29 v52.68,61.52 50.73,59.57 C27.2
  pour Route15: 38.35,47.96 11.28,21.42 21.38,11.6 36.73,26.94 53.44,10.22 83.64,10.22 100.11,26.7 100.32,26.7 116.7,10.32 126.55,20.17 110.06,36.66 110.49,36.66 127.26,53.44 127.26,83.49 110.06,100.68 110.06,100.78 126.81,117.53 126.49,117.53 116.83,127.19 116.66,127.19 99.93,110.46 99.93,111.28 84.03,127.19 53.29,127.19 36.49,110.39 36.49,110.43 19.67,127.25 19.6,127.25 9.74,117.39 9.74,117.04 30.67,96.11 30.67,96.35 50.67,116.35 87.4,116.35 117.21,86.54 117.21,50.98 85.55,19.33 49.8,19.33 46.77,24.55 55.12,48.9 54.24,61.73 52.33,64.63 46.92,62.61 42.07,60.67 41.68,58.65 40.98,56.32 40.3,54.37
DTR
  Top 0.152: C12.1 111.9,63.82 118.79,70.71 123.74,70.71 JP3.DTR
DVDD
  Top 0.152: C5.1 36.59,61.7 39.77,64.88 39.77,66.64 U2.21 39.77,67 40.13,67 U2.22
FILTERED
  Top 0.457: R5.2 106.07,108.19 107.3,106.95 C24.1 107.48,106.77 110.66,109.96 R17.2 110.84,110.13 113.31,112.61 U$16.P$1
FILTERED1
  Top 0.457: R6.2 28.28,106.77 29.88,108.36 C30.1 29.88,108.72 26.87,111.72 R21.2 26.69,111.9 U$18.P$1
FILTERED3
  Top 0.457: 107.3,28.11 109.07,26.34 R10.2 109.25,26.16 U$7.P$1 | 107.3,28.11 109.25,30.05 R4.2 | 107.3,28.11 C10.1
FILTERED5
  Top 0.457: R9.2 30.05,28.28 28.46,29.88 C34.1 28.11,29.88 25.1,26.87 R23.2 24.93,26.69 U$20.P$1
FLYBACK
  Top 0.457: D4.A 119.5,114.9 120.74,116.14 120.74,118.62 U$13.V- 120.56,118.44 115.61,113.49 U$16.P$3
FLYBACK1
  Top 0.457: D2.A 22.63,119.85 23.86,118.62 23.86,116.14 U$18.P$3 23.69,116.32 18.74,121.27 U$17.V-
FLYBACK3
  Top 0.457: U$7.P$3 112.08,21.92 112.08,20.15 114.2,18.03 D6.A 114.37,17.85 116.85,17.85 118.44,16.26 U$5.V-
FLYBACK5
  Top 0.457: 17.85,22.8 19.09,24.04 20.86,24.04 U$20.P$3 | 17.85,22.8 17.85,19.98 16.62,18.74 U$19.V- | 17.85,22.8 D5.A
GND  (via drill 0.38, 0.6)
  Top 0.152: C4.2 C3.2 47.91,82.91 45.25,85.56 45.25,86.27 44.55,86.97 C1.2 44.56,92.15 v45.11,92.7 45.11,116.67 R3.1 | 61.34,71.24 61.34,69.47 C18.1 61.52,69.3 61.52,67.53 C11.2 61.34,67.35 59.4,65.41 56.21,65.41 55.97,65.44 U$2.P$1 | 61.34,71.24 61.34,73.01 C17.2 61.34,73.36 61.34,75.13 C15.1 59.43,75.2 v59.26,75.02 | 61.34,71.24 C16.2 | U2.11 36.59,70.53 36.59,70.89 U2.10 36.65,70.99 37.69,70.99 v38.43,71.74 38.36,71.74 37.58,72.51 37.48,72.51 | U2.17 37.83,66.82 38.18,66.82 U2.18 38.26,65.4 v38.57,65.09 | SW1.1 95.99,65.58 v91.39,65.58 87.15,65.58 SW1.2 | 68.24,70.71 67.88,70.71 U$1.P$17 67.88,70.36 67.71,70.18 67,70.18 U$1.P$18 | 68.24,70.71 68.59,70.71 | 68.59,70.71 69.3,70.71 U$1.P$14 | 68.59,70.71 68.77,70.53 U$1.P$15 68.77,70.89 v68.77,72.3 | 68.24,70.71 68.41,70.53 U$1.P$16 | 47.55,68.41 47.2,68.06 46.49,68.06 U2.33 | 47.55,68.41 47.55,68.77 47.2,69.12 46.49,69.12 U2.35 | 66.82,67.53 66.82,67.88 U$1.P$23 | 21.39,74.1 21.39,72.66 B2.5 | 19.63,65.78 19.62,65.94 19.62,67.35 C8.2 | v85.21,108.89 91.04,114.73 R8.1 | C7.1 21.39,67.35 21.39,65.94 21.39,65.83 | 66.82,67.53 66.11,67.53 65.41,66.82 v65.41,66.47 | 66.82,67.53 U$1.P$24 | v44.72,74.42 45.08,74.07 46.14,74.07 U2.45 | v42.6,78.31 42.25,77.96 42.25,76.9 U2.55 | v47.91,68.41 47.55,68.41 | JP3.GND 123.92,83.26 125.16,82.02 125.16,68.59 123.74,67.18 JP4.GND | v34.54,73.43 33.48,73.43 32.88,73.54 32.07,73.72 25.77,73.72 v25.24,74.25 | U2.20 39.26,65.77 v38.57,65.09 | 37.48,72.51 U2.7 | 37.48,72.51 37.48,72.48 39.24,74.25 39.24,76.37 U2.61 39.24,76.72 39.24,78.14 36.24,81.14 36.24,83.26 37.3,84.32 C6.2 37.3,84.68 38.36,85.74
  Top 0.152: 38.36,85.74 39.42,86.8 C2.2 | 38.36,85.74 38.36,81.85 40.84,79.37 40.84,76.9 U2.58 | STEP_DOWN.2 45.08,53.92 C13.2 44.87,53.99 43.63,52.75 C28.2 43.66,52.86 36.77,59.75 C5.2 36.59,59.93 | 36.59,59.93 41.19,64.52 41.19,66.64 U2.24 | 36.59,59.93 35.53,60.99 35.53,62.05 v38.57,65.09
  Route15 0.152: v85.21,108.89 85.13,108.81 | v58.87,26.34 58.87,26.42
  Bottom 0.152: v58.87,26.34 58.87,11.49 J2.9 | JP4.GND 123.57,67 120.21,63.64 105.01,63.64 J1.6
  other vias: 17.68,64.98 17.57,62.69 19.55,62.54 21.5,62.51 23.26,63.29 24.43,64.95 24.82,67.25 25.1,76.3 24.71,78.17 23.97,79.97 21.71,79.76 19.48,79.58 17.93,78.52 17.85,76.33 24.96,69.44
  pour Route15: 82.8,25.89 56.79,26.47 60.22,51.31 58.87,64.1 56.92,66.04 56.92,67.46 55.79,68.59 52.26,68.59 50.88,67.99 49.25,67.56 46.67,66.89 40.41,64.74 38.82,63.14 38.54,63.14 37.58,62.19 35.76,63.22 35.54,71.81 33.45,72.41 33.55,74.71 36.44,74.86 36.4,90.56 36.6,97.45 52.37,109.57 84.56,109.38 111.24,82.49 111.59,53.83 111.6,53.81
  pour Top: 16.55,63.64 16.72,66.5 16.65,68.55 17.47,68.24 17.32,66.54 18.07,65.73 22.45,65.87 23.19,66.61 23.48,70.29 26.38,70.5 25.53,64.42 23.33,61.24 16.62,61.52 16.4,61.73
  pour Route2: 16.86,74.85 16.55,61.59 16.83,61.52 23.33,61.66 25.95,65.83 26.16,67.6 26.38,68.09 26.52,70.64 26.3,74.95 26.09,78.14 25.1,80.68 24.32,80.89 22.98,80.96 16.72,80.5 16.86,80.36
  pour Top: 16.83,74.81 17.32,74.74 17.39,74.81 20.08,74.81 20.79,74.1 23.9,74.1 23.76,73.96 23.69,73.04 26.52,72.9 26.52,77.57 26.09,77.99 26.09,78.42 25.6,78.91 25.6,79.48 25.17,79.9 25.17,80.61 24.89,80.89 23.19,80.89 23.05,80.75 20.65,80.75 20.51,80.61 18.24,80.61 16.86,80.5
JUMPER_INPUT
  Bottom 0.457: BATT1.+ 53.92,70.89 51.97,68.94 51.97,66.11 J4.2
MISO  (via drill 0.38)
  Top 0.152: v51.97,73.89 50.2,73.89 47.38,71.06 46.67,71.06 U2.39
  Bottom 0.152: v51.97,73.89 53.39,72.48 65.05,72.48 67.53,70 70,70 81.85,58.16 103.06,58.16 J1.1
MOSI  (via drill 0.38)
  Top 0.152: v50.73,73.01 48.26,70.53 46.49,70.53 U2.38
  Bottom 0.152: v50.73,73.01 49.32,74.42 47.55,74.42 45.25,76.72 45.25,77.78 45.61,78.14 52.68,78.14 57.28,73.54 91.22,73.54 102.88,61.87 J1.4
N$1
  cutout Route2: 9.69,60.74 9.69,59.61 24.25,59.33 32.21,63.04 34.68,82.84 27.37,83.93 9.83,83.93 9.69,83.79 9.69,82.38 26.94,82.38 27.51,82.24 26.94,69.08 26.87,66.19 26.8,65.55 25.95,64.13 24.54,61.87 24.04,60.81 23.83,60.6 21.43,60.6
N$2
  Top 0.152: STEP_DOWN.4 45.04,55.23 43.98,55.23 C13.1
N$3
  Top 0.152: C2.1 41.06,85.44 41.15,85.35 41.15,82.38 | 41.15,82.38 41.15,78 41.33,77.82 41.33,76.73 U2.57 | 41.15,82.38 40,82.38 Y2.3
N$4
  Top 0.152: 42.77,84.71 C1.1 | 42.77,84.71 42.77,83.33 41.8,82.37 41.8,76.7 U2.56 | Y2.1 42.77,84.71 | 42.77,84.71
N$5  (via drill 0.38)
  Top 0.152: v64.88,67.71 65.58,68.41 66.64,68.41 U$1.P$22 | v62.4,65.94 62.4,68.41 63.11,69.12 C18.2
  Route2 0.152: v64.88,67.71 63.11,65.94 v62.4,65.94
N$6
  Top 0.152: U$1.P$19 66.82,69.65 66.11,69.65 64.17,71.59 64.17,74.07 63.29,74.95 C15.2
N$7
  Top 0.152: B2.2 21.57,70.71 21.57,69.3 C7.2
N$10
  Top 0.152: R8.2 92.1,116.14 88.21,120.03 87.86,120.03 D3.P$1
N$12
  Top 0.152: R3.2 49.14,120.56 50.2,121.62 54.09,121.62 54.98,120.74 D1.P$1
N$14
  cutout Route15: 9.69,60.74 9.69,59.61 24.25,59.33 32.17,62.79 34.72,82.8 27.37,83.93 9.83,83.93 9.69,83.79 9.69,82.38 26.94,82.38 27.51,82.24 27.44,80.89 26.8,65.55 24.54,61.87 23.83,60.6 22.84,60.6
PB5  (via drill 0.38)
  Top 0.152: 57.81,75.48 57.1,74.78 51.44,74.78 50.91,74.25 49.5,74.25 47.2,71.95 46.49,71.95 U2.41 | 57.81,75.48 58.87,76.54 74.07,76.54 104.47,106.95 R5.1 | 57.81,75.48 v57.81,66.29
  Bottom 0.152: v57.81,66.29 59.75,64.35 59.75,18.38 66.47,11.67 J2.6
PE3  (via drill 0.38)
  Top 0.152: J2.3 74.42,11.49 75.66,10.25 80.26,10.25 96.17,26.16 102.53,26.16 107.83,31.47 R4.1 108.01,31.64 108.01,36.59 v79.55,65.05 | v47.38,76.37 45.25,76.37 U2.49
  Bottom 0.152: v47.38,76.37 48.97,74.78 55.33,74.78 56.92,73.19 71.42,73.19 v79.55,65.05
PE4  (via drill 0.38)
  Top 0.152: 44.9,81.32 44.9,77.78 44.72,77.6 44.72,76.9 U2.50 | 44.9,81.32 44.9,85.56 44.55,85.56 43.66,86.44 43.66,91.04 29.7,105.01 R6.1 | 44.9,81.32 v45.25,81.32
  Bottom 0.152: v45.25,81.32 44.12,81.32 42.84,80.03 42.48,80.03 39.73,77.28 39.73,67.95 39.81,67.88 39.81,57.56 35.04,52.79 33.59,52.79 33.59,32.53 55.86,10.25 67.53,10.25 68.77,11.49 J2.5
PE5  (via drill 0.38, 0.6)
  Top 0.152: 34.65,26.52 35,26.16 39.95,26.16 55.86,10.25 70.36,10.25 71.42,11.31 J2.4 | 34.65,26.52 31.64,29.52 R9.1 | v42.78,72.83 43.66,73.72 43.66,74.78 44.19,75.31 44.19,76.37 U2.51 | 34.65,26.52 v34.65,51.34
  Bottom 0.152: v34.65,51.34 34.65,51.55 40.38,57.28 40.38,67.74 40.04,68.08 40.04,70.09 v42.78,72.83
RESET  (via drill 0.38)
  Top 0.152: C12.2 110.49,62.76 109.25,63.99 R1.1 107.83,62.58 | 107.83,62.58 106.95,61.7 J1.5 | 107.83,62.58 105.54,64.88 100.23,64.88 96.34,60.99 SW1.3 95.99,60.99 87.15,60.99 SW1.4 86.8,60.99 81.85,65.94 v70.18,65.94 | v43.06,70.92 36.77,70 U2.12
  Bottom 0.152: v43.06,70.92 44.19,72.12 62.58,72.12 68.77,65.94 v70.18,65.94
RFANT
  Top 0.457: 19.8,69.65 19.45,69.3 C8.1 19.8,69.65 | 19.8,69.65 20.86,70.71 B2.1 | 19.8,69.65 17.68,71.77 U$3.FEED
RFN
  Top 0.152: B2.3 22.81,71.52 U2.9
RFP
  Top 0.152: U2.8 22.67,72.02 B2.4
RX1  (via drill 0.38)
  Top 0.152: v41.54,73.72 41.54,72.66 42.25,71.95 43.31,71.95 44.02,71.24 44.02,70.53 42.78,69.3 42.78,67.18 U2.27
  Bottom 0.152: v41.54,73.72 41.54,78.67 42.6,79.73 124.63,79.73 125.51,78.84 125.51,61.52 123.57,59.57 JP4.TXO
RXD1  (via drill 0.38)
  Top 0.152: v57.81,77.25 51.8,77.25 48.97,74.42 46.49,74.42 U2.46
  Bottom 0.152: v57.81,77.25 122.51,77.25 123.74,76.01 JP3.TXO
SCK  (via drill 0.38)
  Top 0.152: v54.27,73.36 53.21,73.36 49.85,70 46.67,70 U2.37
  Bottom 0.152: v54.27,73.36 54.8,72.83 65.41,72.83 67.88,70.36 72.83,70.36 80.79,62.4 100.59,62.4 103.06,59.93 104.83,59.93 J1.3
SCL  (via drill 0.38)
  Top 0.152: v71.59,19.27 65.41,25.46 65.41,57.63 R2.2 65.41,57.98 65.41,59.04 | 65.41,59.04 65.41,63.99 67.88,66.47 U$1.P$2 | v41.72,69.65 41.72,67.18 U2.25 | 65.41,59.04 v52.33,59.04
  Bottom 0.152: v71.59,19.27 79.2,11.67 J2.1 | v52.33,59.04 v41.72,69.65
SDA  (via drill 0.38)
  Top 0.152: U$1.P$4 68.77,66.29 68.77,60.28 69.65,59.4 R7.2 70,58.69 70,55.51 v72.48,53.03 72.48,15.91 76.72,11.67 J2.2 | v55.86,69.65 52.68,69.65 48.44,65.41 42.78,65.41 42.25,65.94 42.25,66.64 U2.26
  Bottom 0.152: v72.48,53.03 v55.86,69.65
TX1  (via drill 0.38)
  Top 0.152: v56.92,70.71 55.51,72.12 52.68,72.12 52.15,71.59 52.15,71.24 46.67,65.76 43.49,65.76 43.31,65.94 43.31,66.64 U2.28
  Bottom 0.152: v56.92,70.71 59.04,68.59 65.41,68.59 77.43,56.57 123.04,56.57 123.39,56.92 JP4.RXI
TXD1  (via drill 0.38)
  Top 0.152: v54.09,78.14 51.97,78.14 48.79,74.95 46.67,74.95 U2.47
  Bottom 0.152: v54.09,78.14 122.33,78.14 123.21,77.25 124.27,77.25 125.16,76.37 125.16,74.95 123.92,73.72 JP3.RXI
VBAT  (via drill 0.38)
  Top 0.457: v117.73,21.57 118.97,22.8 118.97,23.16 C14.1 | v117.73,21.57 116.5,20.33 D6.C | v117.73,21.57 120.74,18.56 U$5.V+ | 19.27,116.5 v19.09,116.32 17.85,115.08 17.85,114.73 C20.1 | 19.27,116.5 D2.C | 19.27,116.5 16.62,119.15 U$17.V+ | 21.39,19.27 22.63,18.03 C9.1 | 21.39,19.27 v21.21,19.45 D5.C | 21.39,19.27 18.74,16.62 U$19.V+ | 115.79,118.26 114.55,119.5 C19.1 | D4.C 117.03,117.03 v115.97,118.09 115.79,118.26 | v51.09,120.74 52.5,120.74 D1.P$2 | v85.03,121.45 85.03,120.38 D3.P$2 | 115.79,118.26 118.44,120.92 U$13.V+ | 49.64,59.64 49.64,60.53 C27.1 49.5,60.81 52.15,63.46 J4.1 | 49.64,59.64 49.64,57.35 49.11,56.82 STEP_DOWN.1 | STEP_DOWN.3 49.46,59.64 49.64,59.64
  pour Route2: 50.38,37.02 54.34,49.25 53.95,56.57 53.88,59.26 53.78,61.27 52.18,64.56 47.31,62.3 42.64,60.6 40.91,55.05 38.89,47.45 37.19,45.75 12.3,21.64 12.3,21.5 21,12.8 21.43,12.8 36.56,27.93 36.56,27.65 53.67,10.82 82.94,10.54 100.06,27.51 100.34,27.51 116.88,10.96 116.88,11.53 125.65,20.29 109.04,36.91 126.71,53.74 126.43,83.72 109.39,100.48 109.33,101.1 125.88,117.65 125.51,117.59 116.88,126.22 116.6,126.22 99.84,109.46 99.84,109.88 83.79,126.5 53.46,126.57 36.84,109.81 36.27,109.81 19.87,126.22 19.3,126.22 10.75,117.66 10.75,117.1 30.62,96.94 50.28,116.74 87.61,116.74 117.45,86.9 117.45,49.85 85.84,18.67 50.49,18.67 47.06,24.36

### Text on the board
tPlace: GND | CTS | VCC | TXO/TXD1 | RXI/RXD1 | DTR | GND | CTS | VCC | TXO/TXD1 | RXI/RXD1 | DTR | BAT_GND | GND | VBAT | 3V | PB5 | PE4 | PE5 | PE3 | SDA | SCL